# Altium project cjb.PrjPCB
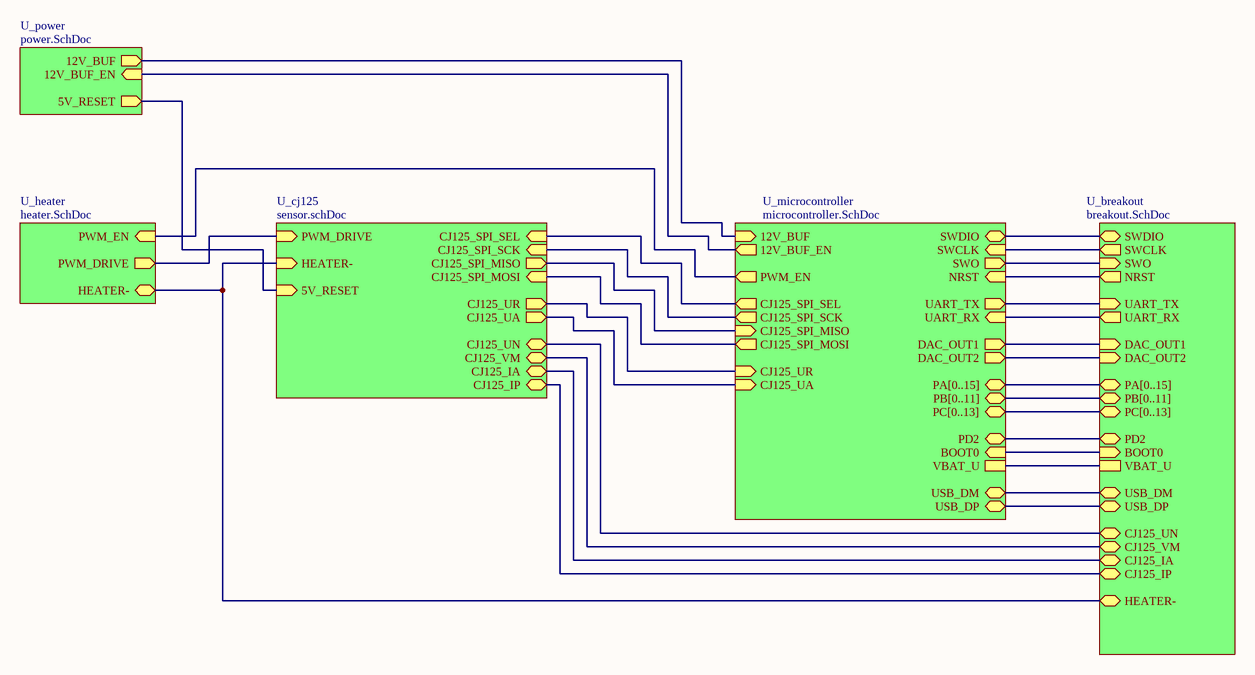
[diagram p0: cjb.SchDoc]
ProjectTitle: Lambda Oxygen Sensor Interface
6 sheets, 137 parts. Net scope: hierarchical (ports join the sheet entries above them; power ports are global).
Board file: cjb.PcbDoc
Sheets:
  cjb.SchDoc
    U_power = power.SchDoc
    U_microcontroller = microcontroller.SchDoc
    U_breakout = breakout.SchDoc
    U_cj125 = sensor.schDoc
    U_heater = heater.SchDoc

## Sheet cjb.SchDoc
size A4; SheetNumber: 1; SheetTotal: 2

### Sub-sheets
U_breakout = breakout.SchDoc: SWDIO (bidir), SWCLK (out), SWO (in), NRST (out), DAC_OUT1 (in), DAC_OUT2 (in), UART_TX (in), UART_RX (out), PD2 (bidir), BOOT0 (in), VBAT_U, PA[0..15] (bidir), PC[0..13] (bidir), HEATER- (bidir), CJ125_IP (bidir), CJ125_IA (bidir), CJ125_VM (bidir), CJ125_UN (bidir), PB[0..11] (bidir), USB_DM (bidir), USB_DP (bidir)
U_cj125 = sensor.schDoc: CJ125_SPI_SCK (in), CJ125_SPI_MISO (out), CJ125_SPI_MOSI (in), CJ125_SPI_SEL (in), CJ125_IP (bidir), CJ125_UA (out), CJ125_UN (bidir), CJ125_IA (bidir), CJ125_VM (bidir), CJ125_UR (out), HEATER- (in), PWM_DRIVE (in), 5V_RESET (in)
U_heater = heater.SchDoc: HEATER- (bidir), PWM_DRIVE (out), PWM_EN (in)
U_microcontroller = microcontroller.SchDoc: SWDIO (bidir), SWCLK (in), SWO (out), NRST (in), DAC_OUT1 (out), DAC_OUT2 (out), UART_TX (out), UART_RX (in), CJ125_SPI_SCK (out), CJ125_SPI_MISO (in), CJ125_SPI_MOSI (out), PD2 (bidir), BOOT0 (in), VBAT_U, CJ125_SPI_SEL (out), PA[0..15] (bidir), PC[0..13] (bidir), CJ125_UA (in), CJ125_UR (in), PB[0..11] (bidir), 12V_BUF_EN (out), 12V_BUF (in), PWM_EN (out), USB_DM (bidir), USB_DP (bidir)
U_power = power.SchDoc: 5V_RESET (out), 12V_BUF_EN (in), 12V_BUF (out)

### Nets
5V_RESET: sheet U_power/5V_RESET, sheet U_cj125/5V_RESET
12V_BUF: sheet U_power/12V_BUF, sheet U_microcontroller/12V_BUF
12V_BUF_EN: sheet U_power/12V_BUF_EN, sheet U_microcontroller/12V_BUF_EN
BOOT0: sheet U_microcontroller/BOOT0, sheet U_breakout/BOOT0
CJ125_IA: sheet U_breakout/CJ125_IA, sheet U_cj125/CJ125_IA
CJ125_IP: sheet U_breakout/CJ125_IP, sheet U_cj125/CJ125_IP
CJ125_SPI_MISO: sheet U_microcontroller/CJ125_SPI_MISO, sheet U_cj125/CJ125_SPI_MISO
CJ125_SPI_MOSI: sheet U_microcontroller/CJ125_SPI_MOSI, sheet U_cj125/CJ125_SPI_MOSI
CJ125_SPI_SCK: sheet U_microcontroller/CJ125_SPI_SCK, sheet U_cj125/CJ125_SPI_SCK
CJ125_SPI_SEL: sheet U_microcontroller/CJ125_SPI_SEL, sheet U_cj125/CJ125_SPI_SEL
CJ125_UA: sheet U_microcontroller/CJ125_UA, sheet U_cj125/CJ125_UA
CJ125_UN: sheet U_breakout/CJ125_UN, sheet U_cj125/CJ125_UN
CJ125_UR: sheet U_microcontroller/CJ125_UR, sheet U_cj125/CJ125_UR
CJ125_VM: sheet U_breakout/CJ125_VM, sheet U_cj125/CJ125_VM
DAC_OUT1: sheet U_microcontroller/DAC_OUT1, sheet U_breakout/DAC_OUT1
DAC_OUT2: sheet U_microcontroller/DAC_OUT2, sheet U_breakout/DAC_OUT2
HEATER-: sheet U_breakout/HEATER-, sheet U_cj125/HEATER-, sheet U_heater/HEATER-
NRST: sheet U_microcontroller/NRST, sheet U_breakout/NRST
PD2: sheet U_microcontroller/PD2, sheet U_breakout/PD2
PWM_DRIVE: sheet U_cj125/PWM_DRIVE, sheet U_heater/PWM_DRIVE
PWM_EN: sheet U_microcontroller/PWM_EN, sheet U_heater/PWM_EN
SWCLK: sheet U_microcontroller/SWCLK, sheet U_breakout/SWCLK
SWDIO: sheet U_microcontroller/SWDIO, sheet U_breakout/SWDIO
SWO: sheet U_microcontroller/SWO, sheet U_breakout/SWO
UART_RX: sheet U_microcontroller/UART_RX, sheet U_breakout/UART_RX
UART_TX: sheet U_microcontroller/UART_TX, sheet U_breakout/UART_TX
USB_D_N: sheet U_microcontroller/USB_DM, sheet U_breakout/USB_DM
USB_D_P: sheet U_microcontroller/USB_DP, sheet U_breakout/USB_DP
VBAT_U: sheet U_microcontroller/VBAT_U, sheet U_breakout/VBAT_U

### Buses and harness runs
bus sheet U_breakout/PA[0..15] = sheet U_microcontroller/PA[0..15]
bus sheet U_breakout/PB[0..11] = sheet U_microcontroller/PB[0..11]
bus sheet U_breakout/PC[0..13] = sheet U_microcontroller/PC[0..13]

### Notes on the sheet
- Title
- Title:
- Project:
- Size:
- Date:
- File:
- E
- Number:
- Time:
- Revision:
- Sheet
- of

## Sheet power.SchDoc
size A4
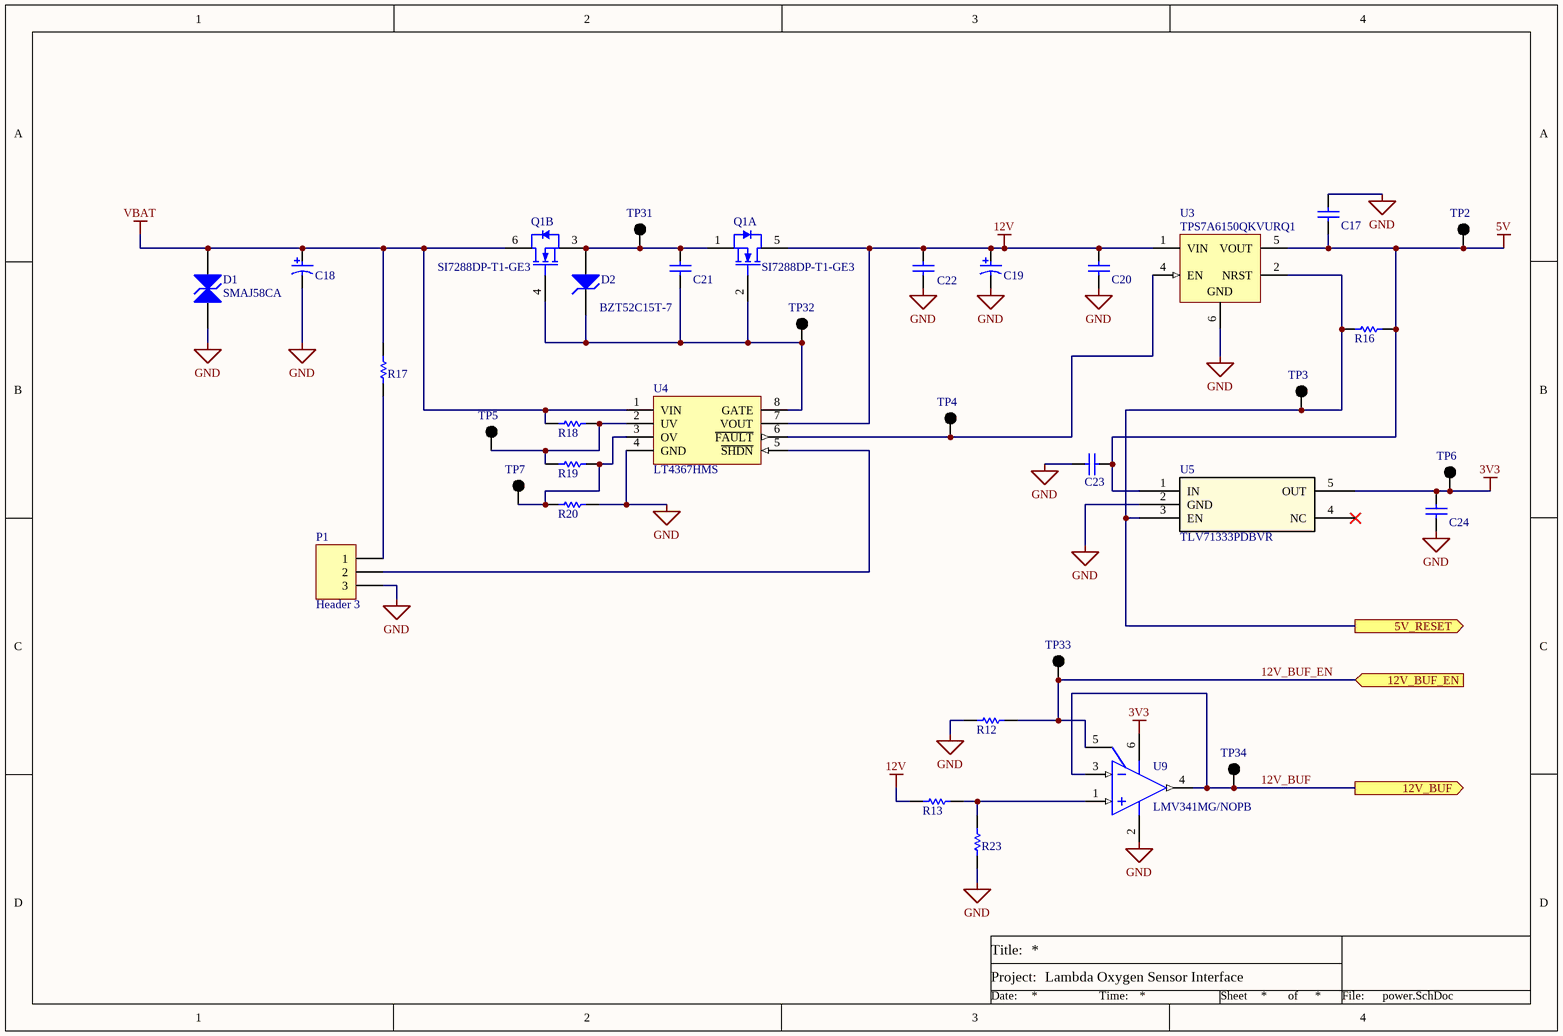
[diagram p1: power.SchDoc]

### Parts
C17  Generic 0805 Capacitor  [0805]  (value not drawn)
C18  Generic Electrolytic Capacitor  [NIC-UUX2A470MNL1GS_M]  (value not drawn)
C19  Generic Electrolytic Capacitor  [NIC-UUX2A470MNL1GS_M]  (value not drawn)
C20  Generic 0805 Capacitor  [0805]  (value not drawn)
C21  Generic 0805 Capacitor  [0805]  (value not drawn)
C22  Generic 0805 Capacitor  [0805]  (value not drawn)
C23  Generic 0805 Capacitor  [0805]  (value not drawn)
C24  Generic 0805 Capacitor  [0805]  (value not drawn)
D1  SMAJ58CA  [VISH-DO-214AC-2_M]
D2  BZT52C15T-7  [DIOD-SOD123-2_V]
P1  Header 3  [HDR1X3]
Q1  SI7288DP-T1-GE3  [VISH-POWERPAKSO-8_A_V]  (parts A,B of 2)
R12  Generic 0603 Resistor  [0603]  (value not drawn)
R13  Generic 0603 Resistor  [0603]  (value not drawn)
R16  Generic 0603 Resistor  [0603]  (value not drawn)
R17  Generic 0603 Resistor  [0603]  (value not drawn)
R18  Generic 0603 Resistor  [0603]  (value not drawn)
R19  Generic 0603 Resistor  [0603]  (value not drawn)
R20  Generic 0603 Resistor  [0603]  (value not drawn)
R23  Generic 0603 Resistor  [0603]  (value not drawn)
TP2  5001  [KSTN-5001]  (value not drawn)
TP3  5001  [KSTN-5001]  (value not drawn)
TP4  5001  [KSTN-5001]  (value not drawn)
TP5  5001  [KSTN-5001]  (value not drawn)
TP6  5001  [KSTN-5001]  (value not drawn)
TP7  5001  [KSTN-5001]  (value not drawn)
TP31  5001  [KSTN-5001]  (value not drawn)
TP32  5001  [KSTN-5001]  (value not drawn)
TP33  5001  [KSTN-5001]  (value not drawn)
TP34  5001  [KSTN-5001]  (value not drawn)
U3  TPS7A6150QKVURQ1  [KVU0005A_M]
U4  LT4367HMS  [MSOP8_M]
U5  TLV71333PDBVR  [DBV5-M]
U9  LMV341MG/NOPB  [DCK0006A_M]

### Ports
5V_RESET (out), 12V_BUF (out), 12V_BUF_EN (in)

### Nets
3V3: C24.2 TP6.1 U5.5(OUT) U9.6(V+)
5V: C17.1 C23.2 R16.2 TP2.1 U3.5(VOUT) U5.1(IN)
12V: C19.1 C20.2 C22.2 Q1.5(G2) R13.1 U3.1(VIN) U4.7(VOUT)
GND: C17.2 C18.2 C19.2 C20.1 C22.1 C23.1 C24.1 D1.1(A1) P1.3 R12.2 R20.2 R23.1 U3.6(GND) U4.4(GND) U5.2(GND) U9.2(GND)
VBAT: C18.1 D1.2(A2) Q1.6(G2) R17.2 R18.1 U4.1(VIN)
5V_RESET: R16.1 TP3.1 U3.2(NRST) U5.3(EN) ; port 5V_RESET
12V_BUF: TP34.1 U9.3(IN-) U9.4(OUT) ; port 12V_BUF
12V_BUF_EN: R12.1 TP33.1 U9.5(~{SHDN}) ; port 12V_BUF_EN
NetC21_1: C21.1 D2.2(K) Q1.2(G2) Q1.4(G2) TP32.1 U4.8(GATE)
NetC21_2: C21.2 D2.1(A) Q1.1(S2) Q1.3(S2) TP31.1
NetP1_1: P1.1 R17.1
NetP1_2: P1.2 U4.5(~{SHDN})
NetR13_2: R13.2 R23.2 U9.1(IN+)
NetR18_2: R18.2 R19.1 TP5.1 U4.2(UV)
NetR19_2: R19.2 R20.1 TP7.1 U4.3(OV)
NetTP4_1: TP4.1 U3.4(EN) U4.6(~{FAULT})

Not connected (* = marked no-connect by the designer): U5 4(NC)*

### Notes on the sheet
- Title
- Title:
- Project:
- Size:
- Date:
- File:
- E
- Number:
- Time:
- Revision:
- Sheet
- of

### Library data of the parts
C17 C20-C24 = C_0805: Value: *; Specifications: *
C18 C19 = C_can: Generic PCAP_10x10 Can Aluminum Electrolytic Capacitor
D1 = SMAJ58CA: Transient Voltage Suppressor, 6.40 to 231 V, 58 V Stand-off Voltage, Bi-Directional, -55 to 155 degC, 2-pin DO-214AC, Pb-Free, Tape and Reel; Manufacturer: Vishay Semiconductor; PartNumber: SMAJ58CA-E3/5A; VWM (V): 58; IFSM: 40 A; VBR Bi-Directional (V): 6.4 to 231; ID (uA): 2; PPPM (W): 400, 300; ComponentLink2Description: Datasheet; ComponentLink1URL: http://www.vishay.com/; ComponentLink2URL: http://www.vishay.com/docs/88390/smaj50a.pdf; PackageReference: DO-214AC-2; Operating Junction and Storage Temperature Range: -55 to 150 degC; DatasheetVersion: 12/8/2013; ComponentLink3Description: Package Specification; RoHS: TRUE; Mounting Technology: Surface Mount; ComponentLink1Description: Manufacturer URL; PackageDescription: 2-Pin DO-214AC (SMA), Body 4.245 x 2.665 mm; ComponentLink3URL: http://www.vishay.com/docs/88390/smaj50a.pdf; Packing: Tape and Reel; Supplier 1: Digi-Key; Supplier Part Number 1: SMAJ58CALFCT-ND
D2 = BZT52C15T: Zener Diode 15V 300mW ±6% Surface Mount SOD-523; Manufacturer: Diodes Inc; PartNumber: BZT52C16-7-F; Maximum Reverse Current: 0.1 uA; Tol V: 5.56% Typ.; Maximum Zener Impedance f: 1 kHz ZZK=200 Ohm; Voltage Zener: 16 V Typ.; Packing: Tape and Reel; Power Max: 500 mW; ComponentLink2URL: http://www.diodes.com/datasheets/ds18004.pdf; PackageDescription: 2-Pin SOD123, Body 2.7 x 1.55 mm, Height 1.45 mm; ComponentLink3Description: Package Specification; Mounting Technology: Surface Mount; PackageReference: SOD123; ComponentLink2Description: Datasheet; RoHS: TRUE; ComponentLink3URL: http://www.diodes.com/datasheets/ap02002.pdf; Operating Temperature: -65 to 150 degC; DatasheetVersion: Rev. 37-2; ComponentLink1Description: Manufacturer URL; ComponentLink1URL: http://www.diodes.com/; PackageVersion: Rev. 79
P1 = Header 3: Header, 3-Pin; LatestRevisionDate: 17-Jul-2002; LatestRevisionNote: Re-released for DXP Platform.; Publisher: Altium Limited
Q1 = SI7288DP: Dual N-Channel (D-S) MOSFET, 40 V, 20 A, -55 to 150 degC, 8-Pin POWERPAKSO-8, RoHS, Tape and Reel; Manufacturer: Vishay; Gate Charge (Qg) @ Vgs: 15nC@10V; FET Feature: Standard; Rds On (Max) @ Id, Vgs: 19mOhm@10A,10V; Drain to Source Voltage (Vdss): 40V; Other Names: SI7288DP-T1-GE3DKR; Online Catalog: N-ChannelStandardFETs; Power - Max: 15.6W; PCN Assembly/Origin: MultipleFabracationChanges09/Jul/2014; Input Capacitance (Ciss) @ Vds: 565pF@20V; Current - Continuous Drain (Id) @ 25°C: 20A; Vgs(th) (Max) @ Id: 2.8V@250µA; FET Type: 2N-Channel(Dual); Package Reference: POWERPAKSO-8; Datasheet URL: http://www.vishay.com/docs/65366/si7288dp.pdf; Package Description: 8-Pin Surface Mount Device, Body 6.15 x 5.155 mm, Pitch 1.27 mm; Manufacturer URL: http://www.vishay.com/; Package / Case: PowerPAK®SO-8Dual; Category: DiscreteSemiconductorProducts; Mounting Type: SurfaceMount; Standard Package: 1; Mounting Technology: SurfaceMount; Series: TrenchFET®; Datasheet Version: Rev. A, 10/2009; Supplier Device Package: PowerPAK®SO-8Dual; Family: FETs-Arrays; Packaging: Digi-Reel®
R12 R13 R16-R20 R23 = R_0603: Value: *; Specifications: *
TP2-TP7 TP31-TP34 = TP5001: Test Point, Black, 1-Pin THD, RoHS, Bulk; Manufacturer: Keystone; Other Names: 5001K; Catalog Drawings: 5000Series; Alternate Color: 5004K-ND / -TESTPOINTPCMINI.040"DYELLOW / 5003K-ND / -TESTPOINTPCMINI.040"DORANGE / 5002K-ND / -TESTPOINTPCMINI.040"DWHITE / 5000K-ND / -TESTPOINTPCMINI.040"DRED; Kits: DKTGRS232C-KIT-ND / -TTLCONVERTER; Online Catalog: ColorCodedTestPoints; Datasheet URL: https://ciiva.com/datasheet-click-2917627?src=ciiva&sig=bd195616; Mounting Type: 0.040"(1.02mm)HoleDiameter; Family: TestPoints; RoHS Information: RoHSComplianceStatement; Datasheet Version: Rev. G, 12/2008; Color: Black; Category: TestandMeasurement; Standard Package: 100; Manufacturer URL: http://www.keyelco.com/; Material: Base,Nylon46,UL94V-0; Type: PCTestPoint,Miniature; Terminal: 0.010"x0.020"(0.25mmx0.51mm)PhosphorBronzeWire,SilverPlated; Series: THM; Packaging: Bulk
U3 = TPS7A6150-Q1: Single Output Automotive LDO, 300 mA, Fixed 5 V Output, 4 to 40 V Input, with Ultra-Low IQ, 5-pin PFM (KVU), -40 to 125 degC, Green (RoHS & no Sb/Br); Manufacturer: Texas Instruments; Vin(Min)(V): 4; Fixed Output Options(V): 5; Vdo(Typ)(mV): 300; Accuracy(%): 2; Iq(Typ)(mA): 0.02; Iout(Max)(A): 0.3; SubFamily: Single Channel LDO; Vin(Max)(V): 40; PackageReference: KVU0005A; ComponentLink2URL: http://www.ti.com/general/docs/lit/getliterature.tsp?genericPartNumber=TPS7A6150-Q1&fileType=pdf; PackageDescription: 5-Pin Plastic Flange Mount, Body 6.1 x 6.6 mm, Pitch 1.14 mm; Vout Adj(Max)(V): 5; ComponentLink1Description: Manufacturer URL; ComponentLink1URL: http://www.ti.com/; DatasheetVersion: SLVSA62G; PartNumber: TPS7A6150QKVURQ1; ComponentLink2Description: Datasheet; Mounting Technology: Surface Mount; PackageVersion: 4205521-3/D; Vout Adj(Min)(V): 5; ComponentLink3Description: Package Specification; Eco-Plan: Green (RoHS & no Sb/Br); Code_JEDEC: TO-252; ComponentLink3URL: http://www.ti.com/lit/ml/mpsf019/mpsf019.pdf; Supplier 1: Digi-Key; Supplier Part Number 1: 296-36856-6-ND
U4 = LT4367: 100V Overvoltage, Undervoltage and Reverse Supply Protection Controller; ComponentLink1Description: Manufacturer URL; ComponentLink3Description: Package Specification; ComponentLink2URL: http://cds.linear.com/docs/en/datasheet/4356fa.pdf; ComponentLink3URL: http://cds.linear.com/docs/en/packaging/05081661_F_MS.pdf; ComponentLink1URL: http://www.linear.com/; ComponentLink2Description: Datasheet
U5 = TLV71333PDBVR: REG LINEAR 3.3V 150MA SOT23-5; Manufacturer_Part_Number: TLV71333PDBVR; Supplier 1: Digi-Key; Supplier Part Number 1: 296-35591-6-ND
U9 = LMV341: Single with Shutdown/Dual/Quad General Purpose, 2.7V, Rail-to-Rail Output, 125°C, Operational Amplifiers, 6-pin SC-70, Pb-Free; Manufacturer: Texas Instruments; PowerWise: N; PackageTopMarking: A78*XTT; RoHS: Y; Package Reference: DCK0006A; CompType: Amplifiers; ComponentLink1URL: http://www.ti.com/general/docs/lit/getliterature.tsp?genericPartNumber=LMV341-N&fileType=pdf; PinCount: 6; ComponentLink1Description: Datasheet URL; PackageDescription: Molded SC-70, 2 x 1.25 x .9mm, 6 Lead, 0.65mm Pitch

## Sheet microcontroller.SchDoc
size A4; SheetNumber: 2; SheetTotal: 3
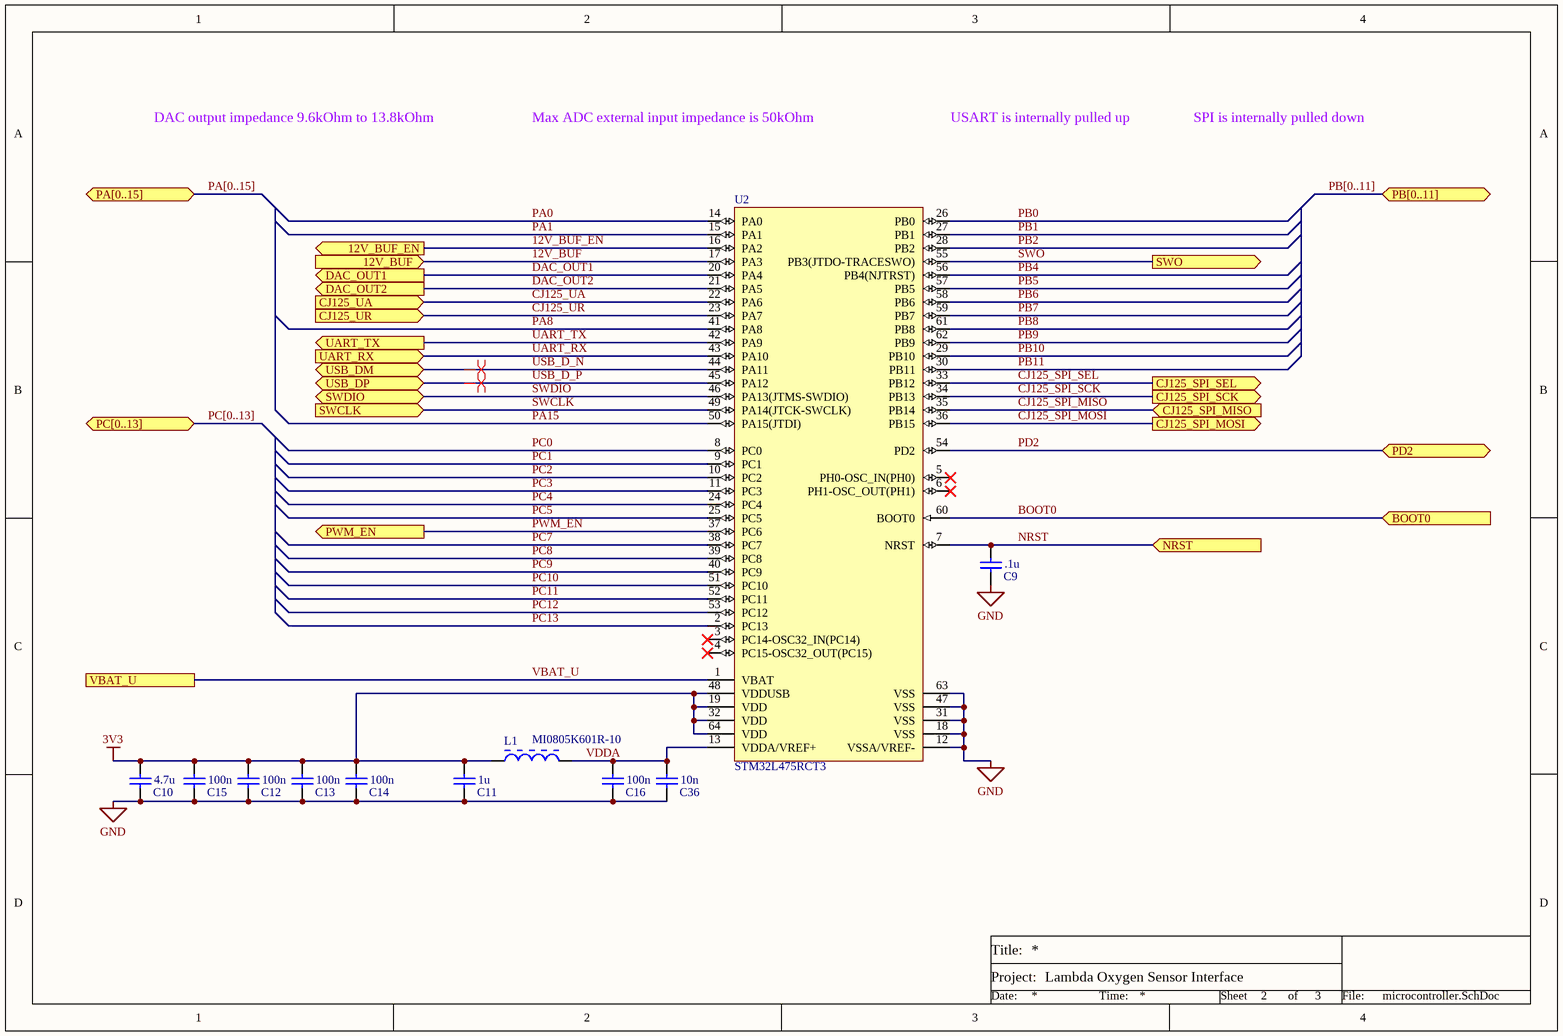
[diagram p2: microcontroller.SchDoc]

### Parts
C9  value .1u  [0805]  (hidden comment: Generic 0805 Capacitor)
C10  value 4.7u  [0805]  (hidden comment: Generic 0805 Capacitor)
C11  value 1u  [0805]  (hidden comment: Generic 0805 Capacitor)
C12  value 100n  [0805]  (hidden comment: Generic 0805 Capacitor)
C13  value 100n  [0805]  (hidden comment: Generic 0805 Capacitor)
C14  value 100n  [0805]  (hidden comment: Generic 0805 Capacitor)
C15  value 100n  [0805]  (hidden comment: Generic 0805 Capacitor)
C16  value 100n  [0805]  (hidden comment: Generic 0805 Capacitor)
C36  value 10n  [0805]  (hidden comment: Generic 0805 Capacitor)
L1  MI0805K601R-10  [LIRD-MI0805K601R-10-2_V]
U2  STM32L475RCT3  [STM-LQFP64_L]

### Ports
12V_BUF (in), 12V_BUF_EN (out), BOOT0 (in), CJ125_SPI_MISO (in), CJ125_SPI_MOSI (out), CJ125_SPI_SCK (out), CJ125_SPI_SEL (out), CJ125_UA (in), CJ125_UR (in), DAC_OUT1 (out), DAC_OUT2 (out), NRST (in), PA[0..15] (bidir), PB[0..11] (bidir), PC[0..13] (bidir), PD2 (bidir), PWM_EN (out), SWCLK (in), SWDIO (bidir), SWO (out), UART_RX (in), UART_TX (out), USB_DM (bidir), USB_DP (bidir), VBAT_U

### Nets
3V3: C10.2 C11.2 C12.2 C13.2 C14.2 C15.2 L1.1 U2.19(VDD) U2.32(VDD) U2.48(VDDUSB) U2.64(VDD)
GND: C9.1 C10.1 C11.1 C12.1 C13.1 C14.1 C15.1 C16.1 C36.1 U2.12(VSSA/VREF-) U2.18(VSS) U2.31(VSS) U2.47(VSS) U2.63(VSS)
12V_BUF: U2.17(PA3) ; port 12V_BUF
12V_BUF_EN: U2.16(PA2) ; port 12V_BUF_EN
BOOT0: U2.60(BOOT0) ; port BOOT0
CJ125_SPI_MISO: U2.35(PB14) ; port CJ125_SPI_MISO
CJ125_SPI_MOSI: U2.36(PB15) ; port CJ125_SPI_MOSI
CJ125_SPI_SCK: U2.34(PB13) ; port CJ125_SPI_SCK
CJ125_SPI_SEL: U2.33(PB12) ; port CJ125_SPI_SEL
CJ125_UA: U2.22(PA6) ; port CJ125_UA
CJ125_UR: U2.23(PA7) ; port CJ125_UR
DAC_OUT1: U2.20(PA4) ; port DAC_OUT1
DAC_OUT2: U2.21(PA5) ; port DAC_OUT2
NRST: C9.2 U2.7(NRST) ; port NRST
PA0: U2.14(PA0)
PA1: U2.15(PA1)
PA8: U2.41(PA8)
PA15: U2.50(PA15(JTDI))
PB0: U2.26(PB0)
PB1: U2.27(PB1)
PB2: U2.28(PB2)
PB4: U2.56(PB4(NJTRST))
PB5: U2.57(PB5)
PB6: U2.58(PB6)
PB7: U2.59(PB7)
PB8: U2.61(PB8)
PB9: U2.62(PB9)
PB10: U2.29(PB10)
PB11: U2.30(PB11)
PC0: U2.8(PC0)
PC1: U2.9(PC1)
PC2: U2.10(PC2)
PC3: U2.11(PC3)
PC4: U2.24(PC4)
PC5: U2.25(PC5)
PC7: U2.38(PC7)
PC8: U2.39(PC8)
PC9: U2.40(PC9)
PC10: U2.51(PC10)
PC11: U2.52(PC11)
PC12: U2.53(PC12)
PC13: U2.2(PC13)
PD2: U2.54(PD2) ; port PD2
PWM_EN: U2.37(PC6) ; port PWM_EN
SWCLK: U2.49(PA14(JTCK-SWCLK)) ; port SWCLK
SWDIO: U2.46(PA13(JTMS-SWDIO)) ; port SWDIO
SWO: U2.55(PB3(JTDO-TRACESWO)) ; port SWO
UART_RX: U2.43(PA10) ; port UART_RX
UART_TX: U2.42(PA9) ; port UART_TX
USB_D_N: U2.44(PA11) ; port USB_DM
USB_D_P: U2.45(PA12) ; port USB_DP
VBAT_U: U2.1(VBAT) ; port VBAT_U
VDDA: C16.2 C36.2 L1.2 U2.13(VDDA/VREF+)

Not connected (* = marked no-connect by the designer): U2 3(PC14-OSC32_IN(PC14))* 4(PC15-OSC32_OUT(PC15))* 5(PH0-OSC_IN(PH0))* 6(PH1-OSC_OUT(PH1))*

### Buses and harness runs
bus PA[0..15] = port PA[0..15]
bus PB[0..11] = port PB[0..11]
bus PC[0..13] = port PC[0..13]

### Layout directives
differential pair: USB_D_N, USB_D_P

### Notes on the sheet
- DAC output impedance 9.6kOhm to 13.8kOhm
- Max ADC external input impedance is 50kOhm
- USART is internally pulled up
- SPI is internally pulled down
- Title
- Title:
- Project:
- Size:
- Date:
- File:
- E
- Number:
- Time:
- Revision:
- Sheet
- of

### Library data of the parts
C9-C16 C36 = C_0805: Specifications: *
L1 = MI0805K: Chip Bead for Power Filtering, 1500 mA, 600 Ohm, -40 to 125 degC, 0805 (2012 Metric), RoHS, Tape and Reel; Manufacturer: Laird; Filter Type: PowerLine; Current Rating (Max): 1.5A; Catalog Drawings: (HI,HZ,LI,MI)0805Series_1.10mmMax.Height; Impedance @ Frequency: 600Ohm@100MHz; Number of Lines: 1; DC Resistance (DCR) (Max): 100mOhm; Other Names: 240-2390-1; Kits: 240-2227-ND-KITEMIFERRITEBEADCHIPSMD; Online Catalog: MISeries; Standard Package: 1; Datasheet Version: Rev. A, 01/2004; Height (Max): 0.043"(1.10mm); Category: Filters; Operating Temperature: -40degC~125degC; Package Description: 2-Pin Surface Mount Device, Body 2 x 1.25 mm; Package / Case: 0805(2012Metric); Package Reference: MI0805K601R-10-2; Packaging: CutTape(CT); Ratings: -; Mounting Type: SurfaceMount; Datasheet URL: https://datasheet.ciiva.com/3082/mi0805k601r-10-a-vp-3082219.pdf; Size / Dimension: 0.079"Lx0.049"W(2.00mmx1.25mm); Family: FerriteBeadsandChips; Manufacturer URL: https://www.lairdtech.com; Series: MI
U2 = STM32L475RCT3: Ultra-Low-Power ARM Cortex-M4 32-bit MCU+FPU, 256 KB Flash, 128 KB Internal RAM, 51 I/Os, 64-Pin LQFP, -40 to 125 degC, Tray; Operating Frequency(F) (Processor speed) (MHz): 80; Internal RAM Size (kB): 128; I/Os (High Current): 51; D/A Converter: 2; Supply Voltage(Vcc) min (V): 1.71; FLASH Size (Prog) (kB): 256; Package: LQFP64; Packing: Tray; DatasheetVersion: Rev. 4; Mounting Technology: Surface Mount; Core: ARM Cortex-M4; Package Description: 64-Pin Low-profile Quad Flat Package, Body 10 x 10 mm, Pitch 0.5 mm; ComponentLink1Description: Datasheet; ComponentLink1URL: http://www.st.com/content/ccc/resource/technical/document/datasheet/90/51/73/d2/53/60/4f/5f/DM00172872.pdf/files/DM00172872.pdf/jcr:content/translations/en.DM00172872.pdf; Supplier 1: Digi-Key; Supplier Part Number 1: 497-16840-ND

## Sheet breakout.SchDoc
size A4
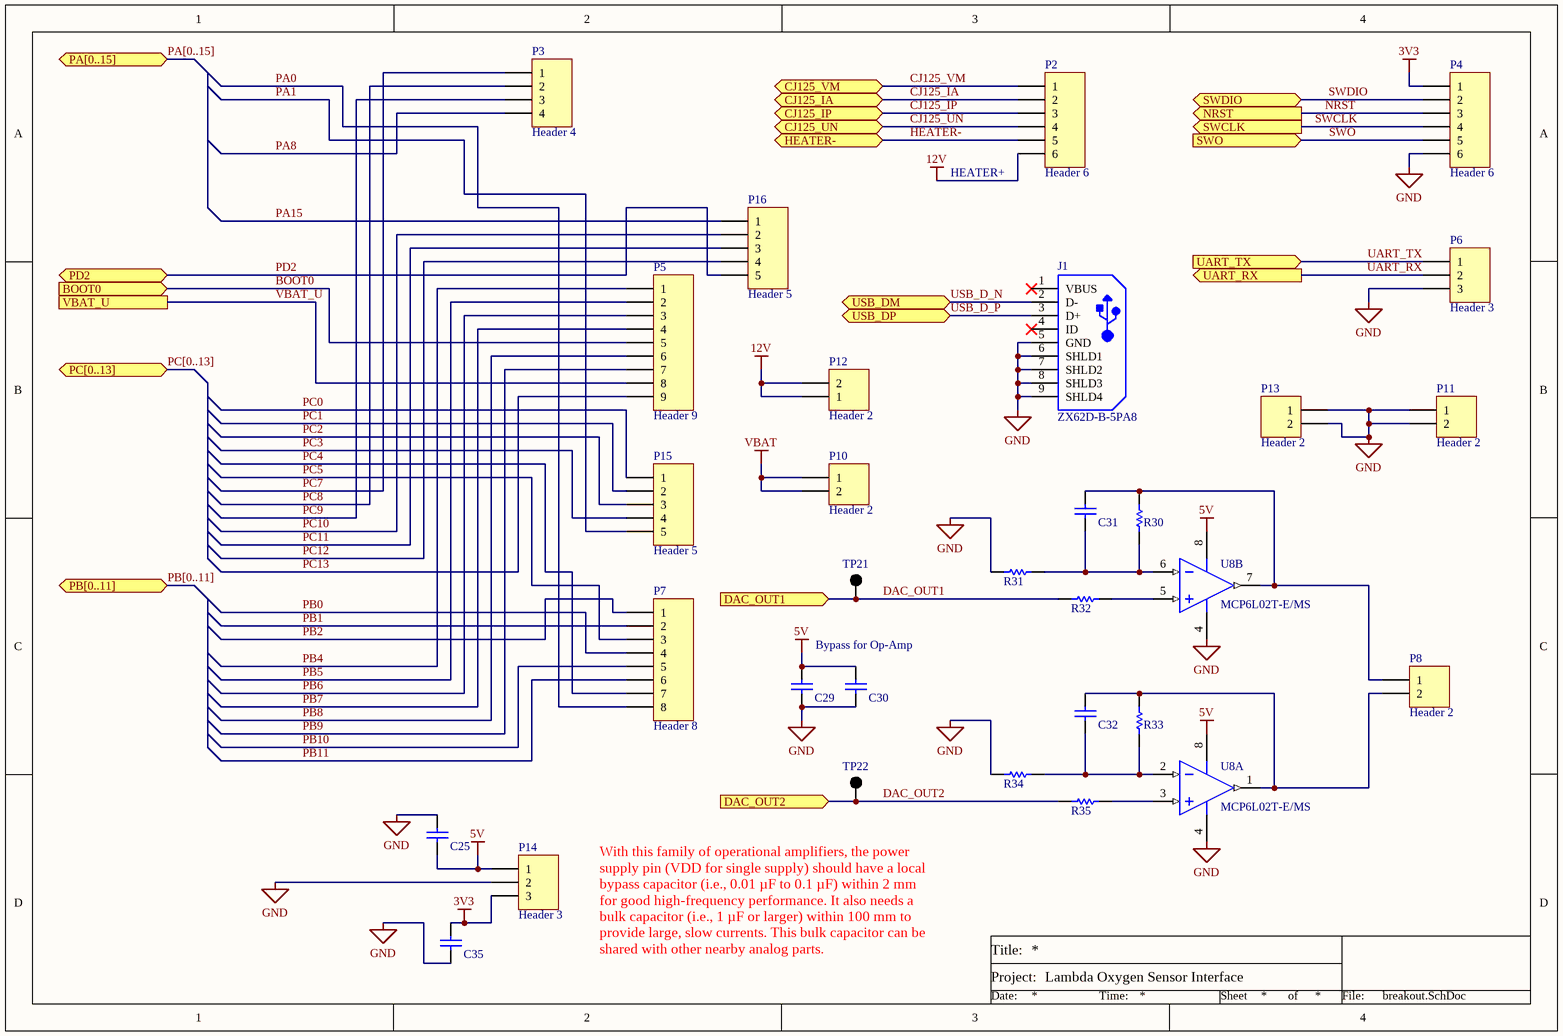
[diagram p3: breakout.SchDoc]

### Parts
C25  Generic 0805 Capacitor  [0805]  (value not drawn)
C29  Generic 0805 Capacitor  [0805]  (value not drawn)
C30  Generic 0805 Capacitor  [0805]  (value not drawn)
C31  Generic 0805 Capacitor  [0805]  (value not drawn)
C32  Generic 0805 Capacitor  [0805]  (value not drawn)
C35  Generic 0805 Capacitor  [0805]  (value not drawn)
J1  ZX62D-B-5PA8  [HIRO-ZX62D-B-5PA8_V]
P2  Header 6  [HDR1X6]
P3  Header 4  [HDR1X4]
P4  Header 6  [HDR1X6]
P5  Header 9  [HDR1X9]
P6  Header 3  [HDR1X3]
P7  Header 8  [HDR1X8]
P8  Header 2  [HDR1X2]
P10  Header 2  [HDR1X2]
P11  Header 2  [HDR1X2]
P12  Header 2  [HDR1X2]
P13  Header 2  [HDR1X2]
P14  Header 3  [HDR1X3]
P15  Header 5  [HDR1X5]
P16  Header 5  [HDR1X5]
R30  Generic 0603 Resistor  [0603]  (value not drawn)
R31  Generic 0603 Resistor  [0603]  (value not drawn)
R32  Generic 0603 Resistor  [0603]  (value not drawn)
R33  Generic 0603 Resistor  [0603]  (value not drawn)
R34  Generic 0603 Resistor  [0603]  (value not drawn)
R35  Generic 0603 Resistor  [0603]  (value not drawn)
TP21  5001  [KSTN-5001]  (value not drawn)
TP22  5001  [KSTN-5001]  (value not drawn)
U8  MCP6L02T-E/MS  [MSOP8_M]  (parts A,B of 2)

### Ports
BOOT0 (in), CJ125_IA (bidir), CJ125_IP (bidir), CJ125_UN (bidir), CJ125_VM (bidir), DAC_OUT1 (in), DAC_OUT2 (in), HEATER- (bidir), NRST (out), PA[0..15] (bidir), PB[0..11] (bidir), PC[0..13] (bidir), PD2 (bidir), SWCLK (out), SWDIO (bidir), SWO (in), UART_RX (out), UART_TX (in), USB_DM (bidir), USB_DP (bidir), VBAT_U

### Nets
3V3: C35.2 P4.1 P14.3
5V: C25.2 C29.2 C30.2 P14.1 U8.8(VDD)
12V: P2.6 P12.1 P12.2
GND: C25.1 C29.1 C30.1 C35.1 J1.5(GND) J1.6(SHLD1) J1.7(SHLD2) J1.8(SHLD3) J1.9(SHLD4) P4.6 P6.3 P11.1 P11.2 P13.1 P13.2 P14.2 R31.1 R34.1 U8.4(VSS)
VBAT: P10.1 P10.2
BOOT0: P5.5 ; port BOOT0
CJ125_IA: P2.2 ; port CJ125_IA
CJ125_IP: P2.3 ; port CJ125_IP
CJ125_UN: P2.4 ; port CJ125_UN
CJ125_VM: P2.1 ; port CJ125_VM
DAC_OUT1: R32.1 TP21.1 ; port DAC_OUT1
DAC_OUT2: R35.1 TP22.1 ; port DAC_OUT2
HEATER-: P2.5 ; port HEATER-
NRST: P4.3 ; port NRST
PA0: P7.8
PA1: P15.5
PA8: P3.4
PA15: P16.1
PB0: P7.4
PB1: P7.2
PB2: P7.1
PB4: P5.1
PB5: P5.2
PB6: P5.3
PB7: P5.4
PB8: P5.6
PB9: P5.7
PB10: P7.5
PB11: P7.6
PC0: P15.1
PC1: P15.2
PC2: P15.3
PC3: P15.4
PC4: P7.7
PC5: P7.3
PC7: P3.1
PC8: P3.2
PC9: P3.3
PC10: P16.2
PC11: P16.3
PC12: P16.4
PC13: P5.9
PD2: P16.5 ; port PD2
SWCLK: P4.4 ; port SWCLK
SWDIO: P4.2 ; port SWDIO
SWO: P4.5 ; port SWO
UART_RX: P6.2 ; port UART_RX
UART_TX: P6.1 ; port UART_TX
USB_D_N: J1.2(D-) ; port USB_DM
USB_D_P: J1.3(D+) ; port USB_DP
VBAT_U: P5.8 ; port VBAT_U
NetC31_1: C31.1 R30.1 R31.2 U8.6(VINB-)
NetC31_2: C31.2 P8.1 R30.2 U8.7(VOUTB)
NetC32_1: C32.1 R33.1 R34.2 U8.2(VINA-)
NetC32_2: C32.2 P8.2 R33.2 U8.1(VOUTA)
NetR32_2: R32.2 U8.5(VINB+)
NetR35_2: R35.2 U8.3(VINA+)

Not connected (* = marked no-connect by the designer): J1 1(VBUS)* 4(ID)*

### Buses and harness runs
bus PA[0..15] = port PA[0..15]
bus PB[0..11] = port PB[0..11]
bus PC[0..13] = port PC[0..13]

### Notes on the sheet
- (near P2) HEATER+
- Bypass for Op-Amp
- With this family of operational amplifiers, the power supply pin (VDD for single supply) should have a local bypass capacitor (i.e., 0.01 µF to 0.1 µF) within 2 mm for good high-frequency performance. It also needs a bulk capacitor (i.e., 1 µF or larger) within 100 mm to provide large, slow currents. This bulk capacitor can be shared with other nearby analog parts.
- Title
- Title:
- Project:
- Size:
- Date:
- File:
- E
- Number:
- Time:
- Revision:
- Sheet
- of

### Library data of the parts
C25 C29-C32 C35 = C_0805: Value: *; Specifications: *
J1 = Micro_USB: Micro-USB Connector Meeting USB 2.0 Standard, -30 to 85 degC, 5-Pin SMD, RoHS, Tape and Reel; Manufacturer: HiroseElectric; Number of Contacts: 5Contact; Current Rating: 1A; Brand: HiroseConnector; Number of Ports: 1Port; Voltage Rating: 30V; Mounting Angle: Right; Gender: Male; Connector Type: Receptacle; RoHS: Details; Package Reference: ZX62D-B-5PA8; Contact Plating: Gold; Product: MicroUSBTypeBConnectors; Shell Plating: Tin; Datasheet Version: 08/2010; Factory Pack Quantity: 2000; Manufacturer URL: https://www.hirose.com; Standard: USB2.0; Datasheet URL: https://datasheet.ciiva.com/22825/0900766b8118f7b1-22825836.pdf; Package Description: 5-Pin Surface Mount Device, Body 7.5 x 5 mm, Pitch 0.65 mm; Operating Temperature Range: -30Cto+85C; Series: ZX; Contact Material: CopperAlloy; Color: Black; Mounting Technology: SurfaceMount; Product Category: USBConnectors; Termination Style: Solder; Packaging: Reel
P2 P4 = Header 6: Header, 6-Pin; LatestRevisionDate: 17-Jul-2002; LatestRevisionNote: Re-released for DXP Platform.; Publisher: Altium Limited
P3 = Header 4: Header, 4-Pin; LatestRevisionDate: 17-Jul-2002; LatestRevisionNote: Re-released for DXP Platform.; Publisher: Altium Limited
P5 = Header 9: Header, 9-Pin; LatestRevisionDate: 17-Jul-2002; LatestRevisionNote: Re-released for DXP Platform.; Publisher: Altium Limited
P6 P14 = Header 3: Header, 3-Pin; LatestRevisionDate: 17-Jul-2002; LatestRevisionNote: Re-released for DXP Platform.; Publisher: Altium Limited
P7 = Header 8: Header, 8-Pin; LatestRevisionDate: 17-Jul-2002; LatestRevisionNote: Re-released for DXP Platform.; Publisher: Altium Limited
P8 P10-P13 = Header 2: Header, 2-Pin; LatestRevisionDate: 17-Jul-2002; LatestRevisionNote: Re-released for DXP Platform.; Publisher: Altium Limited
P15 P16 = Header 5: Header, 5-Pin; LatestRevisionDate: 17-Jul-2002; LatestRevisionNote: Re-released for DXP Platform.; Publisher: Altium Limited
R30-R35 = R_0603: Value: *; Specifications: *
TP21 TP22 = TP5001: as TP2 on sheet power; Datasheet URL: https://ciiva.com/datasheet-click-2917627?src=ciiva&sig=bd195616; Mounting Type: 0.040"(1.02mm)HoleDiameter; Family: TestPoints; RoHS Information: RoHSComplianceStatement; Datasheet Version: Rev. G, 12/2008; Color: Black; Category: TestandMeasurement; Standard Package: 100; Manufacturer URL: http://www.keyelco.com/; Material: Base,Nylon46,UL94V-0; Type: PCTestPoint,Miniature; Terminal: 0.010"x0.020"(0.25mmx0.51mm)PhosphorBronzeWire,SilverPlated; Series: THM; Packaging: Bulk
U8 = MCP6L02: 1 MHz, 85 Î¼A Dual Op Amp, 8-Pin MSOP, Extended Temperature Range, Tape and Reel; ComponentLink2URL: http://ww1.microchip.com/downloads/en/DeviceDoc/22140b.pdf; PackageDescription: 8-Lead Plastic Micro Small Outline Package (MS) [MSOP]; ComponentLink1URL: http://www.microchip.com/; ComponentLink1Description: Manufacturer URL; RevisionNote: URLs added. DatasheetVersion updated.; PackageVersion: revBB, Aug-2009; ComponentLink3URL: http://www.microchip.com/stellent/groups/techpub_sg/documents/packagingspec/en012702.pdf; ComponentLink2Description: Datasheet; ComponentLink3Description: Package Specification; DatasheetVersion: revB, Sep-2011; PackageReference: MSOP-MS8

## Sheet sensor.schDoc: CJ125 Breakout
size A4; SheetNumber: 2; SheetTotal: 2
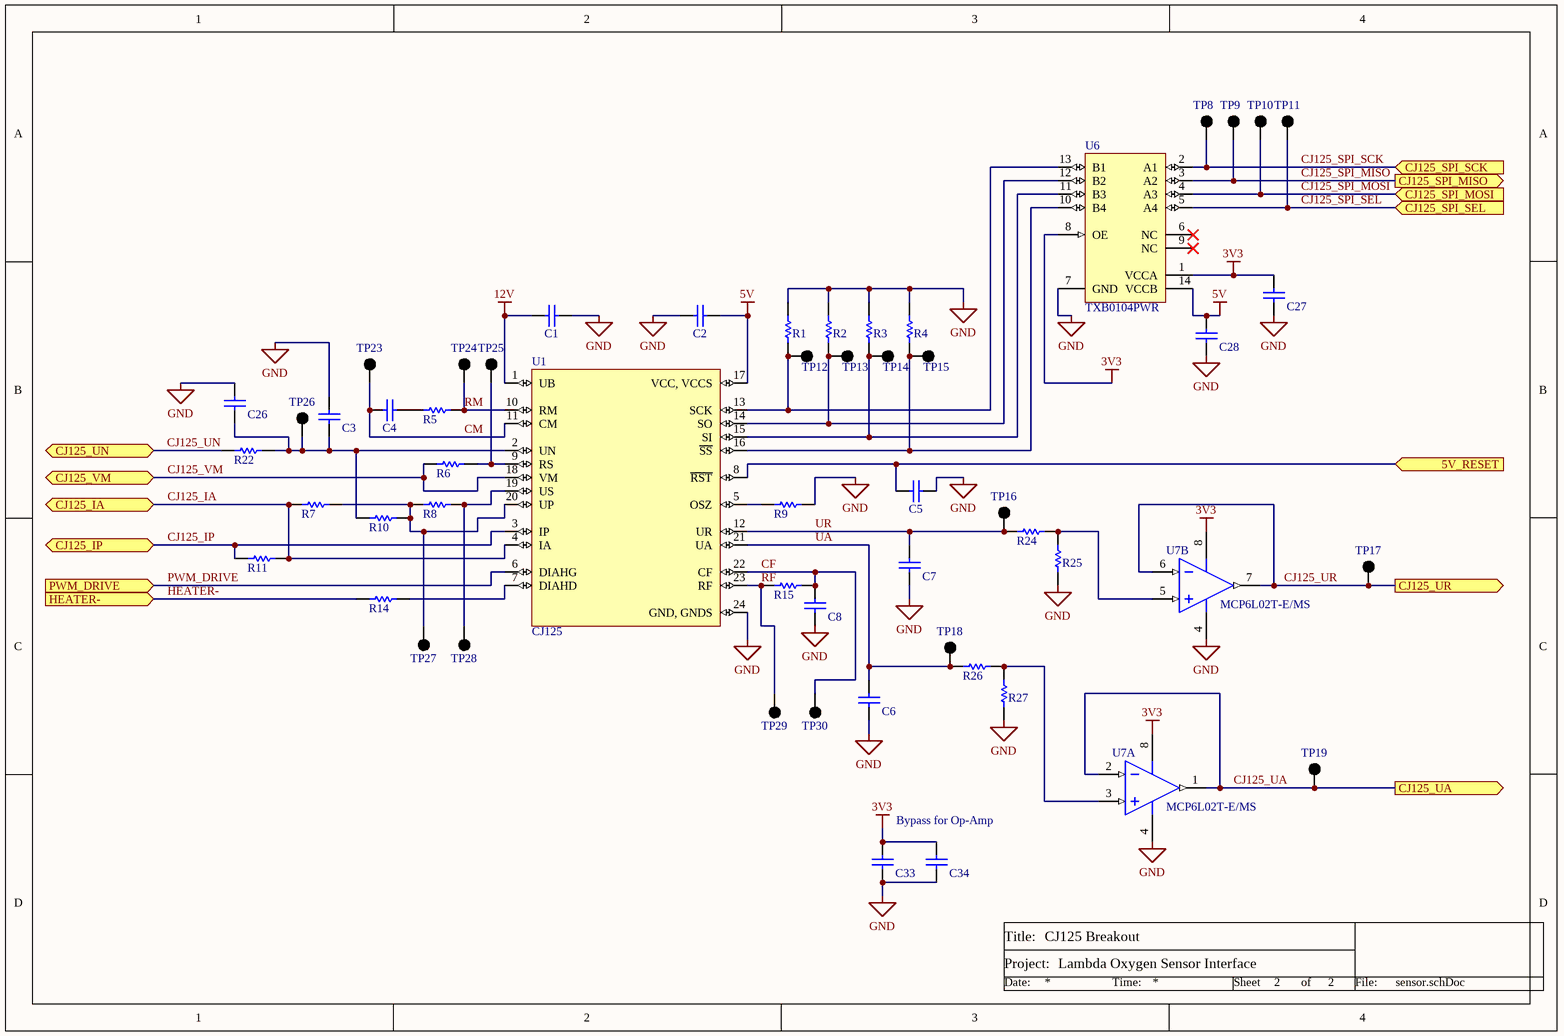
[diagram p4: sensor.schDoc]

### Parts
C1  Generic 0805 Capacitor  [0805]  (value not drawn)
C2  Generic 0805 Capacitor  [0805]  (value not drawn)
C3  Generic 0805 Capacitor  [0805]  (value not drawn)
C4  Generic 0805 Capacitor  [0805]  (value not drawn)
C5  Generic 0805 Capacitor  [0805]  (value not drawn)
C6  Generic 0805 Capacitor  [0805]  (value not drawn)
C7  Generic 0805 Capacitor  [0805]  (value not drawn)
C8  Generic 0805 Capacitor  [0805]  (value not drawn)
C26  Generic 0805 Capacitor  [0805]  (value not drawn)
C27  Generic 0805 Capacitor  [0805]  (value not drawn)
C28  Generic 0805 Capacitor  [0805]  (value not drawn)
C33  Generic 0805 Capacitor  [0805]  (value not drawn)
C34  Generic 0805 Capacitor  [0805]  (value not drawn)
R1  Generic 0603 Resistor  [0603]  (value not drawn)
R2  Generic 0603 Resistor  [0603]  (value not drawn)
R3  Generic 0603 Resistor  [0603]  (value not drawn)
R4  Generic 0603 Resistor  [0603]  (value not drawn)
R5  Generic 0603 Resistor  [0603]  (value not drawn)
R6  Generic 0603 Resistor  [0603]  (value not drawn)
R7  Generic 0603 Resistor  [0603]  (value not drawn)
R8  Generic 0603 Resistor  [0603]  (value not drawn)
R9  Generic 0603 Resistor  [0603]  (value not drawn)
R10  Generic 0603 Resistor  [0603]  (value not drawn)
R11  Generic 0603 Resistor  [0603]  (value not drawn)
R14  Generic 0603 Resistor  [0603]  (value not drawn)
R15  Generic 0603 Resistor  [0603]  (value not drawn)
R22  Generic 0603 Resistor  [0603]  (value not drawn)
R24  Generic 0603 Resistor  [0603]  (value not drawn)
R25  Generic 0603 Resistor  [0603]  (value not drawn)
R26  Generic 0603 Resistor  [0603]  (value not drawn)
R27  Generic 0603 Resistor  [0603]  (value not drawn)
TP8  5001  [KSTN-5001]  (value not drawn)
TP9  5001  [KSTN-5001]  (value not drawn)
TP10  5001  [KSTN-5001]  (value not drawn)
TP11  5001  [KSTN-5001]  (value not drawn)
TP12  5001  [KSTN-5001]  (value not drawn)
TP13  5001  [KSTN-5001]  (value not drawn)
TP14  5001  [KSTN-5001]  (value not drawn)
TP15  5001  [KSTN-5001]  (value not drawn)
TP16  5001  [KSTN-5001]  (value not drawn)
TP17  5001  [KSTN-5001]  (value not drawn)
TP18  5001  [KSTN-5001]  (value not drawn)
TP19  5001  [KSTN-5001]  (value not drawn)
TP23  5001  [KSTN-5001]  (value not drawn)
TP24  5001  [KSTN-5001]  (value not drawn)
TP25  5001  [KSTN-5001]  (value not drawn)
TP26  5001  [KSTN-5001]  (value not drawn)
TP27  5001  [KSTN-5001]  (value not drawn)
TP28  5001  [KSTN-5001]  (value not drawn)
TP29  5001  [KSTN-5001]  (value not drawn)
TP30  5001  [KSTN-5001]  (value not drawn)
U1  CJ125  [SOIC-24]
U6  TXB0104PWR  [PW0014A_M]
U7  MCP6L02T-E/MS  [MSOP8_M]  (parts A,B of 2)

### Ports
5V_RESET (in), CJ125_IA (bidir), CJ125_IP (bidir), CJ125_SPI_MISO (out), CJ125_SPI_MOSI (in), CJ125_SPI_SCK (in), CJ125_SPI_SEL (in), CJ125_UA (out), CJ125_UN (bidir), CJ125_UR (out), CJ125_VM (bidir), HEATER- (in), PWM_DRIVE (in)

### Nets
3V3: C27.2 C33.2 C34.2 U6.1(VCCA) U6.8(OE) U7.8(VDD)
5V: C2.1 C28.2 U1.17(VCC,_VCCS) U6.14(VCCB)
12V: C1.2 U1.1(UB)
GND: C1.1 C2.2 C3.2 C5.2 C6.1 C7.1 C8.1 C26.2 C27.1 C28.1 C33.1 C34.1 R1.2 R2.2 R3.2 R4.2 R9.2 R25.1 R27.1 U1.24(GND,_GNDS) U6.7(GND) U7.4(VSS)
5V_RESET: C5.1 U1.8(~{RST}) ; port 5V_RESET
CF: C8.2 R15.2 TP30.1 U1.22(CF)
CJ125_IA: R7.1 R11.2 U1.4(IA) ; port CJ125_IA
CJ125_IP: R11.1 U1.3(IP) ; port CJ125_IP
CJ125_SPI_MISO: TP9.1 U6.3(A2) ; port CJ125_SPI_MISO
CJ125_SPI_MOSI: TP10.1 U6.4(A3) ; port CJ125_SPI_MOSI
CJ125_SPI_SCK: TP8.1 U6.2(A1) ; port CJ125_SPI_SCK
CJ125_SPI_SEL: TP11.1 U6.5(A4) ; port CJ125_SPI_SEL
CJ125_UA: TP19.1 U7.1(VOUTA) U7.2(VINA-) ; port CJ125_UA
CJ125_UN: R22.1 ; port CJ125_UN
CJ125_UR: TP17.1 U7.6(VINB-) U7.7(VOUTB) ; port CJ125_UR
CJ125_VM: R6.1 U1.18(VM) ; port CJ125_VM
CM: C4.1 TP23.1 U1.11(CM)
HEATER-: R14.1 ; port HEATER-
PWM_DRIVE: U1.6(DIAHG) ; port PWM_DRIVE
RF: R15.1 TP29.1 U1.23(RF)
RM: R5.2 TP24.1 U1.10(RM)
UA: C6.2 R26.1 TP18.1 U1.21(UA)
UR: C7.2 R24.1 TP16.1 U1.12(UR)
NetC3_1: C3.1 C26.1 R10.1 R22.2 TP26.1 U1.2(UN)
NetC4_2: C4.2 R5.1
NetR1_1: R1.1 TP12.1 U1.13(SCK) U6.13(B1)
NetR2_1: R2.1 TP13.1 U1.14(SO) U6.12(B2)
NetR3_1: R3.1 TP14.1 U1.15(SI) U6.11(B3)
NetR4_1: R4.1 TP15.1 U1.16(~{SS}) U6.10(B4)
NetR6_2: R6.2 TP25.1 U1.9(RS)
NetR7_2: R7.2 R8.1 R10.2 TP27.1 U1.20(UP)
NetR8_2: R8.2 TP28.1 U1.19(US)
NetR9_1: R9.1 U1.5(OSZ)
NetR14_2: R14.2 U1.7(DIAHD)
NetR24_2: R24.2 R25.2 U7.5(VINB+)
NetR26_2: R26.2 R27.2 U7.3(VINA+)

Not connected (* = marked no-connect by the designer): U6 6(NC)* 9(NC)*

### Notes on the sheet
- Bypass for Op-Amp
- Title:
- Project:
- Date:
- Time:
- Sheet
- of
- File:
- Title
- Size:
- E
- Number:
- Revision:

### Library data of the parts
C1-C8 C26-C28 C33 C34 = C_0805: Value: *; Specifications: *
R1-R11 R14 R15 R22 R24-R27 = R_0603: Value: *; Specifications: *
TP8-TP19 TP23-TP30 = TP5001: as TP2 on sheet power; Datasheet URL: https://ciiva.com/datasheet-click-2917627?src=ciiva&sig=bd195616; Mounting Type: 0.040"(1.02mm)HoleDiameter; Family: TestPoints; RoHS Information: RoHSComplianceStatement; Datasheet Version: Rev. G, 12/2008; Color: Black; Category: TestandMeasurement; Standard Package: 100; Manufacturer URL: http://www.keyelco.com/; Material: Base,Nylon46,UL94V-0; Type: PCTestPoint,Miniature; Terminal: 0.010"x0.020"(0.25mmx0.51mm)PhosphorBronzeWire,SilverPlated; Series: THM; Packaging: Bulk
U1 = CJ125: 5V 2Mbaud SMT Lambda Probe Interface IC - SOIC-24; Supplier 1: Future Electronics; Package Reference: SOIC-24; Supplier Part Number 1: 0272240104
U6 = TXB0104: 4-Bit Bidirectional Voltage-Level Translator with Automatic Direction Sensing and +/- 15-kV ESD Protection, -40 to 85 degC, 14-Pin TSSOP (PW), Green (RoHS & Sb/Br), Tape and Reel; Manufacturer: Texas Instruments; Dynamic Catalog: TXBSeries; Number of Bits: 4; Voltage - Supply: 1.2V~3.6V,1.65V~5.5V; Other Names: 296-21929-6; Propagation Delay (Max): 4ns; Logic Function: Translator,Bidirectional; Data Rate: 100Mbps; Differential - Input: Output:No/No; Number of Outputs/Channel: 1; Output Type: Logic; Product Training Modules: VoltageLevelTranslation; Number of Channels: 4; Package Reference: PW14; Package Description: 14-Pin Thin Shrink Small Outline Package, Body 5 x 4.4 mm, Pitch 0.65 mm; Datasheet Version: Rev. G, 11/2014; Manufacturer URL: http://www.ti.com/; Series: -; Packaging: Digi-Reel®; Mounting Technology: SurfaceMount; Family: Logic-Translators; Standard Package: 1; Category: IntegratedCircuits(ICs); Supplier Device Package: 14-TSSOP; Datasheet URL: http://www.ti.com/general/docs/lit/getliterature.tsp?genericPartNumber=TXB0104&fileType=pdf; Operating Temperature: -40°C~85°C; Input Type: Logic; Package / Case: 14-TSSOP(0.173",4.40mmWidth)
U7 = MCP6L02: as U8 on sheet breakout; ComponentLink2URL: http://ww1.microchip.com/downloads/en/DeviceDoc/22140b.pdf; PackageDescription: 8-Lead Plastic Micro Small Outline Package (MS) [MSOP]; ComponentLink1URL: http://www.microchip.com/; ComponentLink1Description: Manufacturer URL; RevisionNote: URLs added. DatasheetVersion updated.; PackageVersion: revBB, Aug-2009; ComponentLink3URL: http://www.microchip.com/stellent/groups/techpub_sg/documents/packagingspec/en012702.pdf; ComponentLink2Description: Datasheet; ComponentLink3Description: Package Specification; DatasheetVersion: revB, Sep-2011; PackageReference: MSOP-MS8

## Sheet heater.SchDoc
size A4
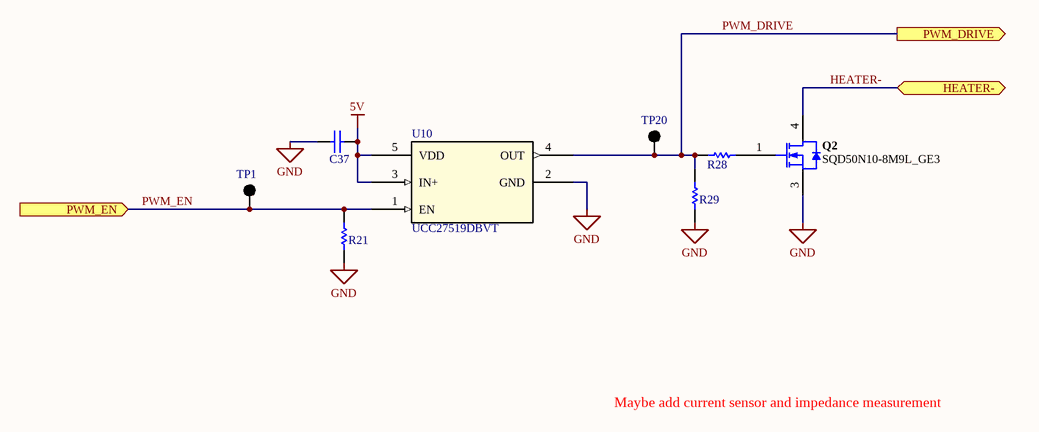
[diagram p5: heater.SchDoc]

### Parts
C37  Generic 0805 Capacitor  [0805]  (value not drawn)
Q2  SQD50N10-8M9L_GE3  [TO-252AA]
R21  Generic 0603 Resistor  [0603]  (value not drawn)
R28  Generic 0603 Resistor  [0603]  (value not drawn)
R29  Generic 0603 Resistor  [0603]  (value not drawn)
TP1  5001  [KSTN-5001]  (value not drawn)
TP20  5001  [KSTN-5001]  (value not drawn)
U10  UCC27519DBVT  [DBV5-M]

### Ports
HEATER- (bidir), PWM_DRIVE (out), PWM_EN (in)

### Nets
5V: C37.2 U10.3(IN+) U10.5(VDD)
GND: C37.1 Q2.3(S) R21.1 R29.1 U10.2(GND)
HEATER-: Q2.4(D) ; port HEATER-
PWM_DRIVE: R28.1 R29.2 TP20.1 U10.4(OUT) ; port PWM_DRIVE
PWM_EN: R21.2 TP1.1 U10.1(EN) ; port PWM_EN
NetQ2_1: Q2.1(G) R28.2

### Notes on the sheet
- Maybe add current sensor and impedance measurement
- Title
- Title:
- Project:
- Size:
- Date:
- File:
- E
- Number:
- Time:
- Revision:
- Sheet
- of

### Library data of the parts
C37 = C_0805: Value: *; Specifications: *
Q2 = SQD50N10: N-Channel 100V 50A (Tc) 136W (Tc) Surface Mount TO-252; Transistor Polarity: N-Channel; Product Category: MOSFET; Package Reference: TO-252AA; Package / Case: TO-252AA-3; Supplier 1: Digi-Key; Supplier Part Number 1: SQD50N10-8M9L_GE3CT-ND
R21 R28 R29 = R_0603: Value: *; Specifications: *
TP1 TP20 = TP5001: as TP2 on sheet power; Datasheet URL: https://ciiva.com/datasheet-click-2917627?src=ciiva&sig=bd195616; Mounting Type: 0.040"(1.02mm)HoleDiameter; Family: TestPoints; RoHS Information: RoHSComplianceStatement; Datasheet Version: Rev. G, 12/2008; Color: Black; Category: TestandMeasurement; Standard Package: 100; Manufacturer URL: http://www.keyelco.com/; Material: Base,Nylon46,UL94V-0; Type: PCTestPoint,Miniature; Terminal: 0.010"x0.020"(0.25mmx0.51mm)PhosphorBronzeWire,SilverPlated; Series: THM; Packaging: Bulk
U10 = UCC27519: Low-Side Gate Driver IC Non-Inverting SOT-23-5

## Nets that join several sheets
3V3: power (C24.2 TP6.1 U5.5 U9.6), microcontroller (11 pins), breakout (C35.2 P4.1 P14.3), sensor (6 pins)
5V: power (6 pins), breakout (5 pins), sensor (C2.1 C28.2 U1.17 U6.14), heater (C37.2 U10.3 U10.5)
12V: power (7 pins), breakout (P2.6 P12.1 P12.2), sensor (C1.2 U1.1)
GND: power (16 pins), microcontroller (14 pins), breakout (19 pins), sensor (22 pins), heater (5 pins)
VBAT: power (6 pins), breakout (P10.1 P10.2)
5V_RESET: power (R16.1 TP3.1 U3.2 U5.3), sensor (C5.1 U1.8)
12V_BUF: power (TP34.1 U9.3 U9.4), microcontroller (U2.17)
12V_BUF_EN: power (R12.1 TP33.1 U9.5), microcontroller (U2.16)
BOOT0: microcontroller (U2.60), breakout (P5.5)
CJ125_IA: breakout (P2.2), sensor (R7.1 R11.2 U1.4)
CJ125_IP: breakout (P2.3), sensor (R11.1 U1.3)
CJ125_SPI_MISO: microcontroller (U2.35), sensor (TP9.1 U6.3)
CJ125_SPI_MOSI: microcontroller (U2.36), sensor (TP10.1 U6.4)
CJ125_SPI_SCK: microcontroller (U2.34), sensor (TP8.1 U6.2)
CJ125_SPI_SEL: microcontroller (U2.33), sensor (TP11.1 U6.5)
CJ125_UA: microcontroller (U2.22), sensor (TP19.1 U7.1 U7.2)
CJ125_UN: breakout (P2.4), sensor (R22.1)
CJ125_UR: microcontroller (U2.23), sensor (TP17.1 U7.6 U7.7)
CJ125_VM: breakout (P2.1), sensor (R6.1 U1.18)
DAC_OUT1: microcontroller (U2.20), breakout (R32.1 TP21.1)
DAC_OUT2: microcontroller (U2.21), breakout (R35.1 TP22.1)
HEATER-: breakout (P2.5), sensor (R14.1), heater (Q2.4)
NRST: microcontroller (C9.2 U2.7), breakout (P4.3)
PA0: microcontroller (U2.14), breakout (P7.8)
PA1: microcontroller (U2.15), breakout (P15.5)
PA8: microcontroller (U2.41), breakout (P3.4)
PA15: microcontroller (U2.50), breakout (P16.1)
PB0: microcontroller (U2.26), breakout (P7.4)
PB1: microcontroller (U2.27), breakout (P7.2)
PB2: microcontroller (U2.28), breakout (P7.1)
PB4: microcontroller (U2.56), breakout (P5.1)
PB5: microcontroller (U2.57), breakout (P5.2)
PB6: microcontroller (U2.58), breakout (P5.3)
PB7: microcontroller (U2.59), breakout (P5.4)
PB8: microcontroller (U2.61), breakout (P5.6)
PB9: microcontroller (U2.62), breakout (P5.7)
PB10: microcontroller (U2.29), breakout (P7.5)
PB11: microcontroller (U2.30), breakout (P7.6)
PC0: microcontroller (U2.8), breakout (P15.1)
PC1: microcontroller (U2.9), breakout (P15.2)
PC2: microcontroller (U2.10), breakout (P15.3)
PC3: microcontroller (U2.11), breakout (P15.4)
PC4: microcontroller (U2.24), breakout (P7.7)
PC5: microcontroller (U2.25), breakout (P7.3)
PC7: microcontroller (U2.38), breakout (P3.1)
PC8: microcontroller (U2.39), breakout (P3.2)
PC9: microcontroller (U2.40), breakout (P3.3)
PC10: microcontroller (U2.51), breakout (P16.2)
PC11: microcontroller (U2.52), breakout (P16.3)
PC12: microcontroller (U2.53), breakout (P16.4)
PC13: microcontroller (U2.2), breakout (P5.9)
PD2: microcontroller (U2.54), breakout (P16.5)
PWM_DRIVE: sensor (U1.6), heater (R28.1 R29.2 TP20.1 U10.4)
PWM_EN: microcontroller (U2.37), heater (R21.2 TP1.1 U10.1)
SWCLK: microcontroller (U2.49), breakout (P4.4)
SWDIO: microcontroller (U2.46), breakout (P4.2)
SWO: microcontroller (U2.55), breakout (P4.5)
UART_RX: microcontroller (U2.43), breakout (P6.2)
UART_TX: microcontroller (U2.42), breakout (P6.1)
USB_D_N: microcontroller (U2.44), breakout (J1.2)
USB_D_P: microcontroller (U2.45), breakout (J1.3)
VBAT_U: microcontroller (U2.1), breakout (P5.8)